# Altium project CBCM test PCB.PrjPCB
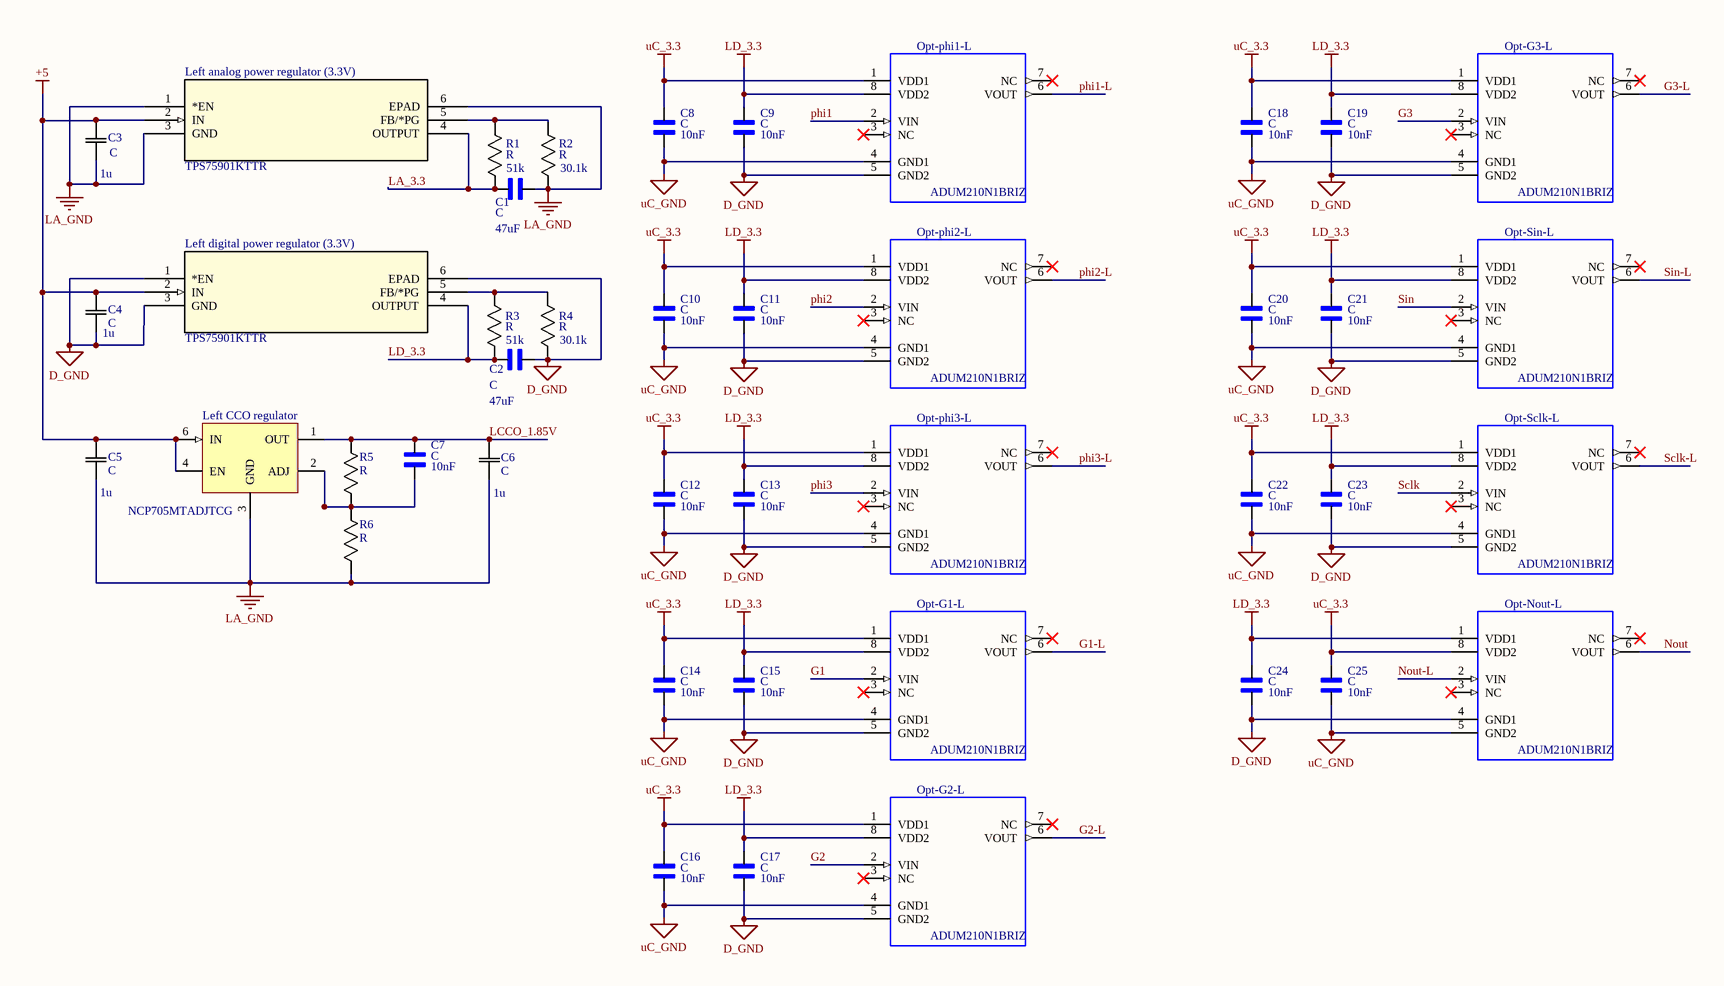
[diagram p0: IC left.SchDoc]
3 sheets, 99 parts. Net scope: global (net labels, ports and power ports of the same name join across sheets).
Board file: CBCM test PCB.PcbDoc
Sheets:
  IC left.SchDoc
  IC right.SchDoc
  IC common.SchDoc

## Sheet IC left.SchDoc
size A3

### Parts
C1  C  value 47uF  [CAPC1608X9N]
C2  C  value 47uF  [CAPC1608X9N]
C3  C  value 1u  [CAP_GRM_188]
C4  C  value 1u  [CAP_GRM_188]
C5  C  value 1u  [CAP_GRM_188]
C6  C  value 1u  [CAP_GRM_188]
C7  C  value 10nF  [CAPC1608X9N]
C8  C  value 10nF  [CAPC1608X9N]
C9  C  value 10nF  [CAPC1608X9N]
C10  C  value 10nF  [CAPC1608X9N]
C11  C  value 10nF  [CAPC1608X9N]
C12  C  value 10nF  [CAPC1608X9N]
C13  C  value 10nF  [CAPC1608X9N]
C14  C  value 10nF  [CAPC1608X9N]
C15  C  value 10nF  [CAPC1608X9N]
C16  C  value 10nF  [CAPC1608X9N]
C17  C  value 10nF  [CAPC1608X9N]
C18  C  value 10nF  [CAPC1608X9N]
C19  C  value 10nF  [CAPC1608X9N]
C20  C  value 10nF  [CAPC1608X9N]
C21  C  value 10nF  [CAPC1608X9N]
C22  C  value 10nF  [CAPC1608X9N]
C23  C  value 10nF  [CAPC1608X9N]
C24  C  value 10nF  [CAPC1608X9N]
C25  C  value 10nF  [CAPC1608X9N]
Left_analog_power_regulator_(3.3V)  TPS75901KTTR  [TO-263-5]
Left_CCO_regulator  NCP705MTADJTCG  [WDFN6]
Left_digital_power_regulator_(3.3V)  TPS75901KTTR  [TO-263-5]
Opt-G1-L  ADUM210N1BRIZ  [SOIC127P1150X330-8N]
Opt-G2-L  ADUM210N1BRIZ  [SOIC127P1150X330-8N]
Opt-G3-L  ADUM210N1BRIZ  [SOIC127P1150X330-8N]
Opt-Nout-L  ADUM210N1BRIZ  [SOIC127P1150X330-8N]
Opt-phi1-L  ADUM210N1BRIZ  [SOIC127P1150X330-8N]
Opt-phi2-L  ADUM210N1BRIZ  [SOIC127P1150X330-8N]
Opt-phi3-L  ADUM210N1BRIZ  [SOIC127P1150X330-8N]
Opt-Sclk-L  ADUM210N1BRIZ  [SOIC127P1150X330-8N]
Opt-Sin-L  ADUM210N1BRIZ  [SOIC127P1150X330-8N]
R1  R  value 51k  [RES_0816]
R2  R  value 30.1k  [RC0603N]
R3  R  value 51k  [RES_0816]
R4  R  value 30.1k  [RC0603N]
R5  R  [RC0603N]
R6  R  [RC0603N]

### Nets
+5: C3.2 C4.2 C5.2 Left_analog_power_regulator_(3.3V).2(IN) Left_CCO_regulator.4(EN) Left_CCO_regulator.6(IN) Left_digital_power_regulator_(3.3V).2(IN)
D_GND: C2.1 C4.1 C9.2 C11.2 C13.2 C15.2 C17.2 C19.2 C21.2 C23.2 C24.2 Left_digital_power_regulator_(3.3V).1(*EN) Left_digital_power_regulator_(3.3V).3(GND) Left_digital_power_regulator_(3.3V).6(EPAD) Opt-G1-L.5(GND2) Opt-G2-L.5(GND2) Opt-G3-L.5(GND2) Opt-Nout-L.4(GND1) Opt-phi1-L.5(GND2) Opt-phi2-L.5(GND2) Opt-phi3-L.5(GND2) Opt-Sclk-L.5(GND2) Opt-Sin-L.5(GND2) R4.2
LA_3.3: C1.2 Left_analog_power_regulator_(3.3V).4(OUTPUT) R1.1
LA_GND: C1.1 C3.1 C5.1 C6.1 Left_analog_power_regulator_(3.3V).1(*EN) Left_analog_power_regulator_(3.3V).3(GND) Left_analog_power_regulator_(3.3V).6(EPAD) Left_CCO_regulator.3(GND) R2.2 R6.2
LCCO_1.85V: C6.2 C7.1 Left_CCO_regulator.1(OUT) R5.1
LD_3.3: C2.2 C9.1 C11.1 C13.1 C15.1 C17.1 C19.1 C21.1 C23.1 C24.1 Left_digital_power_regulator_(3.3V).4(OUTPUT) Opt-G1-L.8(VDD2) Opt-G2-L.8(VDD2) Opt-G3-L.8(VDD2) Opt-Nout-L.1(VDD1) Opt-phi1-L.8(VDD2) Opt-phi2-L.8(VDD2) Opt-phi3-L.8(VDD2) Opt-Sclk-L.8(VDD2) Opt-Sin-L.8(VDD2) R3.1
uC_3.3: C8.1 C10.1 C12.1 C14.1 C16.1 C18.1 C20.1 C22.1 C25.1 Opt-G1-L.1(VDD1) Opt-G2-L.1(VDD1) Opt-G3-L.1(VDD1) Opt-Nout-L.8(VDD2) Opt-phi1-L.1(VDD1) Opt-phi2-L.1(VDD1) Opt-phi3-L.1(VDD1) Opt-Sclk-L.1(VDD1) Opt-Sin-L.1(VDD1)
uC_GND: C8.2 C10.2 C12.2 C14.2 C16.2 C18.2 C20.2 C22.2 C25.2 Opt-G1-L.4(GND1) Opt-G2-L.4(GND1) Opt-G3-L.4(GND1) Opt-Nout-L.5(GND2) Opt-phi1-L.4(GND1) Opt-phi2-L.4(GND1) Opt-phi3-L.4(GND1) Opt-Sclk-L.4(GND1) Opt-Sin-L.4(GND1)
G1: Opt-G1-L.2(VIN)
G1-L: Opt-G1-L.6(VOUT)
G2: Opt-G2-L.2(VIN)
G2-L: Opt-G2-L.6(VOUT)
G3: Opt-G3-L.2(VIN)
G3-L: Opt-G3-L.6(VOUT)
Nout: Opt-Nout-L.6(VOUT)
Nout-L: Opt-Nout-L.2(VIN)
phi1: Opt-phi1-L.2(VIN)
phi1-L: Opt-phi1-L.6(VOUT)
phi2: Opt-phi2-L.2(VIN)
phi2-L: Opt-phi2-L.6(VOUT)
phi3: Opt-phi3-L.2(VIN)
phi3-L: Opt-phi3-L.6(VOUT)
Sclk: Opt-Sclk-L.2(VIN)
Sclk-L: Opt-Sclk-L.6(VOUT)
Sin: Opt-Sin-L.2(VIN)
Sin-L: Opt-Sin-L.6(VOUT)
NetC7_2: C7.2 Left_CCO_regulator.2(ADJ) R5.2 R6.1
NetLeft_analog_power_regulator_(3.3V)_5: Left_analog_power_regulator_(3.3V).5(FB/*PG) R1.2 R2.1
NetLeft_digital_power_regulator_(3.3V)_5: Left_digital_power_regulator_(3.3V).5(FB/*PG) R3.2 R4.1

Not connected (* = marked no-connect by the designer): Opt-G1-L 3(NC)* 7(NC)*; Opt-G2-L 3(NC)* 7(NC)*; Opt-G3-L 3(NC)* 7(NC)*; Opt-Nout-L 3(NC)* 7(NC)*; Opt-phi1-L 3(NC)* 7(NC)*; Opt-phi2-L 3(NC)* 7(NC)*; Opt-phi3-L 3(NC)* 7(NC)*; Opt-Sclk-L 3(NC)* 7(NC)*; Opt-Sin-L 3(NC)* 7(NC)*

### Library data of the parts
C1 C2 = GRM188R60G476ME15D: Multilayer Ceramic Capacitors - 47uF 4V X5R 20% Pad SMD 0603 85C T/R; MF: Murata; Digi-Key_Part_Number: 490-13246-1-ND; SnapEDA_Link: https://www.snapeda.com/parts/GRM188R60G476ME15D/Murata%2520Electronics%2520North%2520America/view-part/?ref=snap; Package: 0603 Murata; Digi-Key_Purchase_URL: https://www.digikey.ca/product-detail/en/murata-electronics-north-america/GRM188R60G476ME15D/490-13246-1-ND/5877454?utm_source=snapeda&utm_medium=aggregator&utm_campaign=symbol; Manufacturer Part Number: GRM188R60G476ME15D
C3-C6 = GRM188R60J105KA0: Imported; Manufacturer Part Number: GRM188R60J105KA01D; Vendor: Murata; Built_By: EMA_UL_Team; Type: DEV; C: Copyright (C) 2015 Accelerated Designs. All rights reserved; RefDes: RefDes
C7-C25 = GRM1885C1H103JA01D: Multilayer Ceramic Capacitor, GRM Series, 0.01 F, 5%, C0G / NP0, 50 V, 0603 [1608 Metric]; MF: Murata; Package: 0603 Murata; Digi-Key_Purchase_URL: https://www.digikey.ca/product-detail/en/murata-electronics-north-america/GRM1885C1H103JA01D/490-9666-1-ND/4934772?utm_source=snapeda&utm_medium=aggregator&utm_campaign=symbol; Digi-Key_Part_Number: 490-9666-1-ND; SnapEDA_Link: https://www.snapeda.com/parts/GRM1885C1H103JA01D/Murata%20Electronics%20North%20America/view-part/?ref=snap; Manufacturer Part Number: GRM1885C1H103JA01D
Left_analog_power_regulator_(3.3V) Left_digital_power_regulator_(3.3V) = TPS75901KTTR: Imported; Vendor: Texas Instruments; Built_By: EMA_UL_Team; C: Copyright (C) 2015 Accelerated Designs. All rights reserved; Manufacturer: Texas Instruments; RefDes: RefDes; Type: DEV; Value: Value; Manufacturer Part Number: TPS75901KTTR
Left_CCO_regulator = NCP705MTADJTCG: 500 mA, Ultra-Low  Quiescent Current, IQ 13 A,  Ultra-Low Noise, LDO  Voltage Regulator; Manufacturer: ON Semiconductor; Manufacturer Part Number: NCP705MTADJTCG; Digi-Key link: https://www.digikey.ca/product-detail/en/on-semiconductor/NCP705MTADJTCG/NCP705MTADJTCGOSCT-ND/8538627
Opt-G1-L Opt-G2-L Opt-G3-L Opt-Nout-L Opt-phi1-L Opt-phi2-L Opt-phi3-L Opt-Sclk-L Opt-Sin-L = ADUM210N1BRIZ: Digital isolator 1-CH 8-Pin SOIC T/R; MF: Analog Devices; Digi-Key_Purchase_URL: https://www.digikey.ca/product-detail/en/analog-devices-inc/ADUM210N1BRIZ/ADUM210N1BRIZ-ND/6072296; Package: SOIC8; Digi-Key_Part_Number: ADUM210N1BRIZ-ND; SnapEDA_Link: https://www.snapeda.com/parts/ACPL-072L-500E/Broadcom/view-part/?ref=snap; Value: *; Manufacturer Part Number: ADUM210N1BRIZ
R1 R3 = RR0816P-513-D: Imported; Vendor: Susumu; Built_By: EMA_UL_Team; C: Copyright (C) 2015 Accelerated Designs. All rights reserved; RefDes: RefDes; Type: DEV; Manufacturer Part Number: RR0816P-513-D
R2 R4 = RT0603BRD0730K1L: Imported; Vendor: Yageo; Built_By: EMA_UL_Team; C: Copyright (C) 2015 Accelerated Designs. All rights reserved; RefDes: RefDes; Type: DEV; Manufacturer Part Number: RT0603BRD0730K1L
R5 = RC0603FR-07130KL: Imported; Vendor: Yageo; Built_By: EMA_UL_Team; Value: 130k; C: Copyright (C) 2015 Accelerated Designs. All rights reserved; RefDes: RefDes; Type: DEV; Manufacturer Part Number: RC0603FR-07130KL
R6 = ERJ-3GEY0R00V: Imported; Vendor: Panasonic; Built_By: EMA_UL_Team; Value: 98.8k; C: Copyright (C) 2015 Accelerated Designs. All rights reserved; RefDes: RefDes; Type: DEV; Manufacturer Part Number: ERJ-3GEY0R00V

## Sheet IC right.SchDoc
size A3
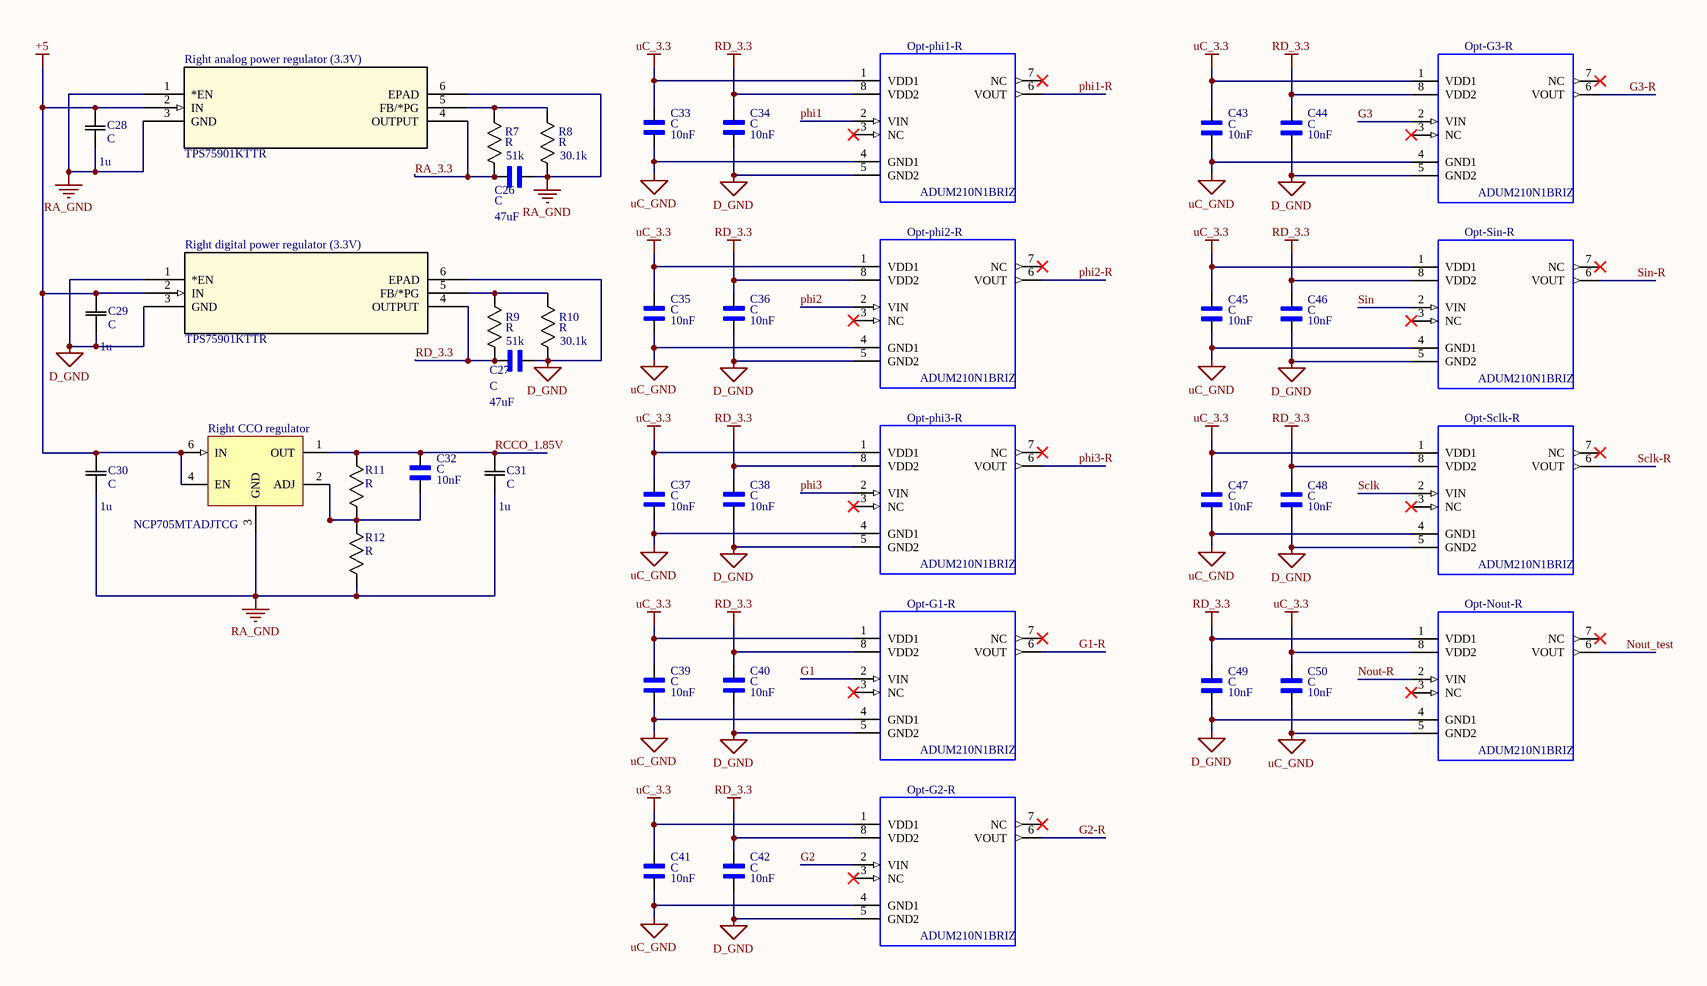
[diagram p1: IC right.SchDoc]

### Parts
C26  C  value 47uF  [CAPC1608X9N]
C27  C  value 47uF  [CAPC1608X9N]
C28  C  value 1u  [CAP_GRM_188]
C29  C  value 1u  [CAP_GRM_188]
C30  C  value 1u  [CAP_GRM_188]
C31  C  value 1u  [CAP_GRM_188]
C32  C  value 10nF  [CAPC1608X9N]
C33  C  value 10nF  [CAPC1608X9N]
C34  C  value 10nF  [CAPC1608X9N]
C35  C  value 10nF  [CAPC1608X9N]
C36  C  value 10nF  [CAPC1608X9N]
C37  C  value 10nF  [CAPC1608X9N]
C38  C  value 10nF  [CAPC1608X9N]
C39  C  value 10nF  [CAPC1608X9N]
C40  C  value 10nF  [CAPC1608X9N]
C41  C  value 10nF  [CAPC1608X9N]
C42  C  value 10nF  [CAPC1608X9N]
C43  C  value 10nF  [CAPC1608X9N]
C44  C  value 10nF  [CAPC1608X9N]
C45  C  value 10nF  [CAPC1608X9N]
C46  C  value 10nF  [CAPC1608X9N]
C47  C  value 10nF  [CAPC1608X9N]
C48  C  value 10nF  [CAPC1608X9N]
C49  C  value 10nF  [CAPC1608X9N]
C50  C  value 10nF  [CAPC1608X9N]
Opt-G1-R  ADUM210N1BRIZ  [SOIC127P1150X330-8N]
Opt-G2-R  ADUM210N1BRIZ  [SOIC127P1150X330-8N]
Opt-G3-R  ADUM210N1BRIZ  [SOIC127P1150X330-8N]
Opt-Nout-R  ADUM210N1BRIZ  [SOIC127P1150X330-8N]
Opt-phi1-R  ADUM210N1BRIZ  [SOIC127P1150X330-8N]
Opt-phi2-R  ADUM210N1BRIZ  [SOIC127P1150X330-8N]
Opt-phi3-R  ADUM210N1BRIZ  [SOIC127P1150X330-8N]
Opt-Sclk-R  ADUM210N1BRIZ  [SOIC127P1150X330-8N]
Opt-Sin-R  ADUM210N1BRIZ  [SOIC127P1150X330-8N]
R7  R  value 51k  [RES_0816]
R8  R  value 30.1k  [RC0603N]
R9  R  value 51k  [RES_0816]
R10  R  value 30.1k  [RC0603N]
R11  R  [RC0603N]
R12  R  [RC0603N]
Right_analog_power_regulator_(3.3V)  TPS75901KTTR  [TO-263-5]
Right_CCO_regulator  NCP705MTADJTCG  [WDFN6]
Right_digital_power_regulator_(3.3V)  TPS75901KTTR  [TO-263-5]

### Nets
+5: C28.2 C29.2 C30.2 Right_analog_power_regulator_(3.3V).2(IN) Right_CCO_regulator.4(EN) Right_CCO_regulator.6(IN) Right_digital_power_regulator_(3.3V).2(IN)
D_GND: C27.1 C29.1 C34.2 C36.2 C38.2 C40.2 C42.2 C44.2 C46.2 C48.2 C49.2 Opt-G1-R.5(GND2) Opt-G2-R.5(GND2) Opt-G3-R.5(GND2) Opt-Nout-R.4(GND1) Opt-phi1-R.5(GND2) Opt-phi2-R.5(GND2) Opt-phi3-R.5(GND2) Opt-Sclk-R.5(GND2) Opt-Sin-R.5(GND2) R10.2 Right_digital_power_regulator_(3.3V).1(*EN) Right_digital_power_regulator_(3.3V).3(GND) Right_digital_power_regulator_(3.3V).6(EPAD)
RA_3.3: C26.2 R7.1 Right_analog_power_regulator_(3.3V).4(OUTPUT)
RA_GND: C26.1 C28.1 C30.1 C31.1 R8.2 R12.2 Right_analog_power_regulator_(3.3V).1(*EN) Right_analog_power_regulator_(3.3V).3(GND) Right_analog_power_regulator_(3.3V).6(EPAD) Right_CCO_regulator.3(GND)
RCCO_1.85V: C31.2 C32.1 R11.1 Right_CCO_regulator.1(OUT)
RD_3.3: C27.2 C34.1 C36.1 C38.1 C40.1 C42.1 C44.1 C46.1 C48.1 C49.1 Opt-G1-R.8(VDD2) Opt-G2-R.8(VDD2) Opt-G3-R.8(VDD2) Opt-Nout-R.1(VDD1) Opt-phi1-R.8(VDD2) Opt-phi2-R.8(VDD2) Opt-phi3-R.8(VDD2) Opt-Sclk-R.8(VDD2) Opt-Sin-R.8(VDD2) R9.1 Right_digital_power_regulator_(3.3V).4(OUTPUT)
uC_3.3: C33.1 C35.1 C37.1 C39.1 C41.1 C43.1 C45.1 C47.1 C50.1 Opt-G1-R.1(VDD1) Opt-G2-R.1(VDD1) Opt-G3-R.1(VDD1) Opt-Nout-R.8(VDD2) Opt-phi1-R.1(VDD1) Opt-phi2-R.1(VDD1) Opt-phi3-R.1(VDD1) Opt-Sclk-R.1(VDD1) Opt-Sin-R.1(VDD1)
uC_GND: C33.2 C35.2 C37.2 C39.2 C41.2 C43.2 C45.2 C47.2 C50.2 Opt-G1-R.4(GND1) Opt-G2-R.4(GND1) Opt-G3-R.4(GND1) Opt-Nout-R.5(GND2) Opt-phi1-R.4(GND1) Opt-phi2-R.4(GND1) Opt-phi3-R.4(GND1) Opt-Sclk-R.4(GND1) Opt-Sin-R.4(GND1)
G1: Opt-G1-R.2(VIN)
G1-R: Opt-G1-R.6(VOUT)
G2: Opt-G2-R.2(VIN)
G2-R: Opt-G2-R.6(VOUT)
G3: Opt-G3-R.2(VIN)
G3-R: Opt-G3-R.6(VOUT)
Nout-R: Opt-Nout-R.2(VIN)
Nout_test: Opt-Nout-R.6(VOUT)
phi1: Opt-phi1-R.2(VIN)
phi1-R: Opt-phi1-R.6(VOUT)
phi2: Opt-phi2-R.2(VIN)
phi2-R: Opt-phi2-R.6(VOUT)
phi3: Opt-phi3-R.2(VIN)
phi3-R: Opt-phi3-R.6(VOUT)
Sclk: Opt-Sclk-R.2(VIN)
Sclk-R: Opt-Sclk-R.6(VOUT)
Sin: Opt-Sin-R.2(VIN)
Sin-R: Opt-Sin-R.6(VOUT)
NetC32_2: C32.2 R11.2 R12.1 Right_CCO_regulator.2(ADJ)
NetR7_2: R7.2 R8.1 Right_analog_power_regulator_(3.3V).5(FB/*PG)
NetR9_2: R9.2 R10.1 Right_digital_power_regulator_(3.3V).5(FB/*PG)

Not connected (* = marked no-connect by the designer): Opt-G1-R 3(NC)* 7(NC)*; Opt-G2-R 3(NC)* 7(NC)*; Opt-G3-R 3(NC)* 7(NC)*; Opt-Nout-R 3(NC)* 7(NC)*; Opt-phi1-R 3(NC)* 7(NC)*; Opt-phi2-R 3(NC)* 7(NC)*; Opt-phi3-R 3(NC)* 7(NC)*; Opt-Sclk-R 3(NC)* 7(NC)*; Opt-Sin-R 3(NC)* 7(NC)*

### Library data of the parts
C26 C27 = GRM188R60G476ME15D: as C1 on sheet IC left; Digi-Key_Part_Number: 490-13246-1-ND; SnapEDA_Link: https://www.snapeda.com/parts/GRM188R60G476ME15D/Murata%2520Electronics%2520North%2520America/view-part/?ref=snap; Package: 0603 Murata; Digi-Key_Purchase_URL: https://www.digikey.ca/product-detail/en/murata-electronics-north-america/GRM188R60G476ME15D/490-13246-1-ND/5877454?utm_source=snapeda&utm_medium=aggregator&utm_campaign=symbol; Manufacturer Part Number: GRM188R60G476ME15D
C28-C31 = GRM188R60J105KA0: as C3 on sheet IC left; RefDes: RefDes
C32-C50 = GRM1885C1H103JA01D: as C7 on sheet IC left; Package: 0603 Murata; Digi-Key_Purchase_URL: https://www.digikey.ca/product-detail/en/murata-electronics-north-america/GRM1885C1H103JA01D/490-9666-1-ND/4934772?utm_source=snapeda&utm_medium=aggregator&utm_campaign=symbol; Digi-Key_Part_Number: 490-9666-1-ND; SnapEDA_Link: https://www.snapeda.com/parts/GRM1885C1H103JA01D/Murata%20Electronics%20North%20America/view-part/?ref=snap; Manufacturer Part Number: GRM1885C1H103JA01D
Opt-G1-R Opt-G2-R Opt-G3-R Opt-Nout-R Opt-phi1-R Opt-phi2-R Opt-phi3-R Opt-Sclk-R Opt-Sin-R = ADUM210N1BRIZ: as Opt-G1-L on sheet IC left; Digi-Key_Purchase_URL: https://www.digikey.ca/product-detail/en/analog-devices-inc/ADUM210N1BRIZ/ADUM210N1BRIZ-ND/6072296; Package: SOIC8; Digi-Key_Part_Number: ADUM210N1BRIZ-ND; SnapEDA_Link: https://www.snapeda.com/parts/ACPL-072L-500E/Broadcom/view-part/?ref=snap; Value: *; Manufacturer Part Number: ADUM210N1BRIZ
R7 R9 = RR0816P-513-D: as R1 on sheet IC left; RefDes: RefDes; Type: DEV; Manufacturer Part Number: RR0816P-513-D
R8 R10 = RT0603BRD0730K1L: as R2 on sheet IC left; RefDes: RefDes; Type: DEV; Manufacturer Part Number: RT0603BRD0730K1L
R11 = RC0603FR-07130KL: as R5 on sheet IC left; RefDes: RefDes; Type: DEV; Manufacturer Part Number: RC0603FR-07130KL
R12 = ERJ-3GEY0R00V: as R6 on sheet IC left; RefDes: RefDes; Type: DEV; Manufacturer Part Number: ERJ-3GEY0R00V
Right_analog_power_regulator_(3.3V) Right_digital_power_regulator_(3.3V) = TPS75901KTTR: as Left_analog_power_regulator_(3.3V) on sheet IC left; Manufacturer: Texas Instruments; RefDes: RefDes; Type: DEV; Value: Value; Manufacturer Part Number: TPS75901KTTR
Right_CCO_regulator = NCP705MTADJTCG: as Left_CCO_regulator on sheet IC left; Manufacturer Part Number: NCP705MTADJTCG; Digi-Key link: https://www.digikey.ca/product-detail/en/on-semiconductor/NCP705MTADJTCG/NCP705MTADJTCGOSCT-ND/8538627

## Sheet IC common.SchDoc
size A3
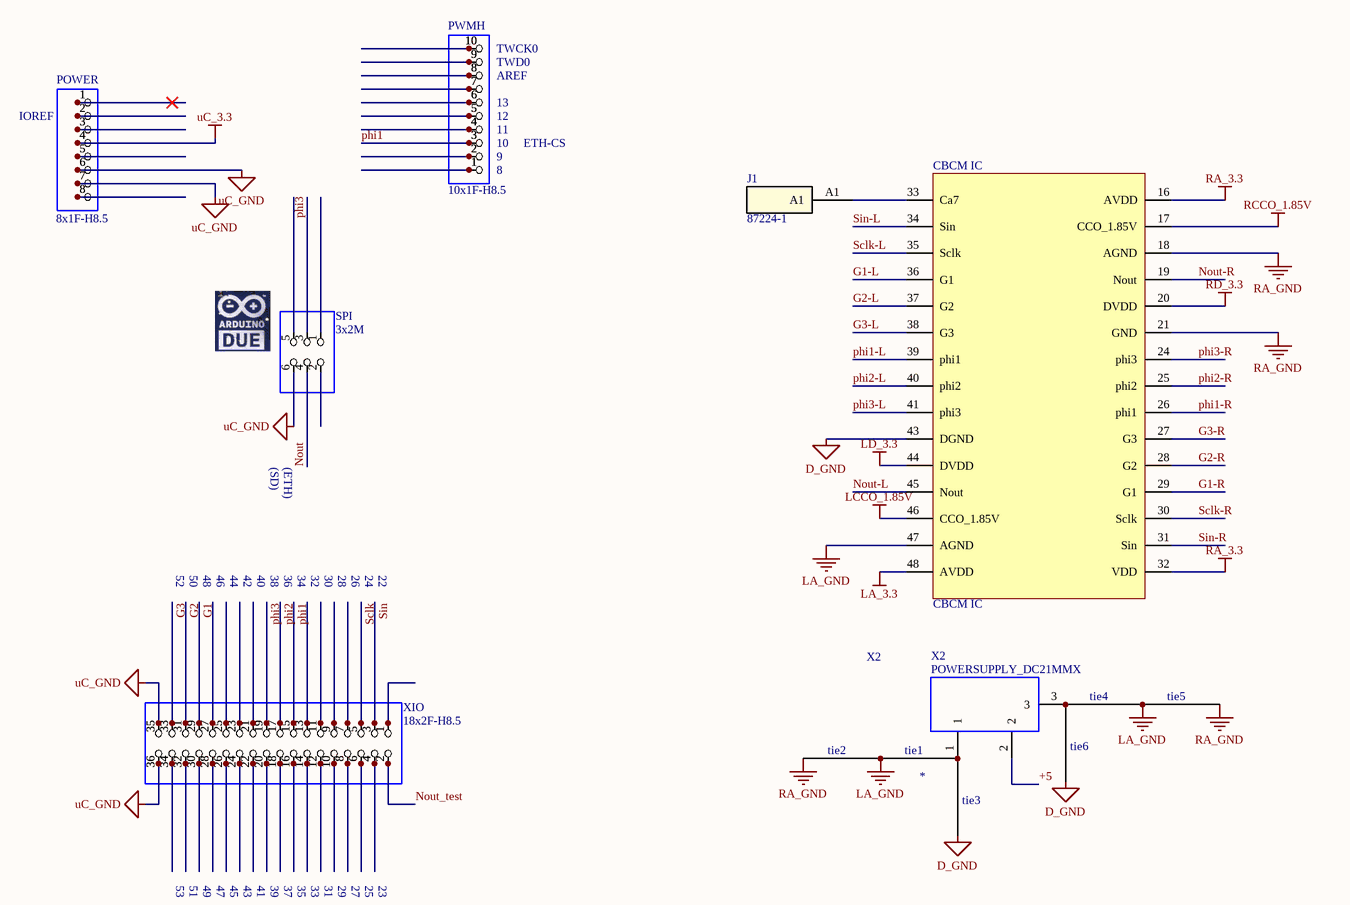
[diagram p2: IC common.SchDoc]

### Parts
CBCM_IC  CBCM IC  [PGA85x11]
J1  87224-1  [87224-1]
POWER  8x1F-H8.5  [1X08]
PWMH  10x1F-H8.5  [1X10]
SPI  3x2M  [2X03]
tie1  Net Tie  [net_tie]  (value not drawn)  (net tie, no BOM)
tie2  Net Tie  [net_tie]  (value not drawn)  (net tie, no BOM)
tie3  Net Tie  [net_tie]  (value not drawn)  (net tie, no BOM)
tie4  Net Tie  [net_tie]  (value not drawn)  (net tie, no BOM)
tie5  Net Tie  [net_tie]  (value not drawn)  (net tie, no BOM)
tie6  Net Tie  [net_tie]  (value not drawn)  (net tie, no BOM)
X2  *  [POWERSUPPLY_DC-21MM]
XIO  18x2F-H8.5  [2X18]

### Nets
+5: X2.2
D_GND: CBCM_IC.43(DGND) tie3.0 tie6.0
LA_3.3: CBCM_IC.48(AVDD)
LA_GND: CBCM_IC.47(AGND) tie1.0 tie2.1 tie4.1 tie5.0
LCCO_1.85V: CBCM_IC.46(CCO_1.85V)
LD_3.3: CBCM_IC.44(DVDD)
RA_3.3: CBCM_IC.16(AVDD) CBCM_IC.32(VDD)
RA_GND: CBCM_IC.18(AGND) CBCM_IC.21(GND) tie2.0 tie5.1
RCCO_1.85V: CBCM_IC.17(CCO_1.85V)
RD_3.3: CBCM_IC.20(DVDD)
uC_3.3: POWER.4
uC_GND: POWER.6 POWER.7 SPI.6 XIO.35 XIO.36
G1: XIO.29
G1-L: CBCM_IC.36(G1)
G1-R: CBCM_IC.29(G1)
G2: XIO.31
G2-L: CBCM_IC.37(G2)
G2-R: CBCM_IC.28(G2)
G3: XIO.33
G3-L: CBCM_IC.38(G3)
G3-R: CBCM_IC.27(G3)
Nout: SPI.4
Nout-L: CBCM_IC.45(Nout)
Nout-R: CBCM_IC.19(Nout)
Nout_test: XIO.2
phi1: PWMH.3 XIO.15
phi1-L: CBCM_IC.39(phi1)
phi1-R: CBCM_IC.26(phi1)
phi2: XIO.17
phi2-L: CBCM_IC.40(phi2)
phi2-R: CBCM_IC.25(phi2)
phi3: SPI.3 XIO.19
phi3-L: CBCM_IC.41(phi3)
phi3-R: CBCM_IC.24(phi3)
Sclk: XIO.5
Sclk-L: CBCM_IC.35(Sclk)
Sclk-R: CBCM_IC.30(Sclk)
Sin: XIO.3
Sin-L: CBCM_IC.34(Sin)
Sin-R: CBCM_IC.31(Sin)
NetCBCM_IC_33: CBCM_IC.33(Ca7) J1.A1
Nettie1_1: tie1.1 tie3.1 X2.1
Nettie4_0: tie4.0 tie6.1 X2.3

Not connected (* = marked no-connect by the designer): POWER 1* 2 3 5 8; PWMH 1 2 4 5 6 7 8 9 10; SPI 1 2 5; XIO 1 4 6 7 8 9 10 11 12 13 14 16 18 20 21 22 23 24 25 26 27 28 30 32 34

### Notes on the sheet
- (near PWMH) TWCK0
- (near PWMH) TWD0
- (near POWER) IOREF
- (near PWMH) 11
- (near PWMH) 12
- (near PWMH) 13
- (near PWMH) AREF
- (near PWMH) 8
- (near PWMH) 9
- (near PWMH) 10
- (near PWMH) ETH-CS
- (SD)
- (ETH)
- 52
- 50
- 48
- 46
- 44
- 42
- 40
- 38
- 36
- 34
- 32
- 30
- 28
- 26
- 24
- 22
- 53
- 51
- 49
- 47
- 45
- 43
- 41
- 39
- 37
- 35
- 33
- 31
- 29
- 27
- 25
- 23

### Library data of the parts
CBCM_IC = CBCM IC: pin to pad: 16>H1 17>H2 18>J1 19>K1 20>J2 21>L1 24>L2 25>L3 26>K4 27>L4 28>J5 29>K5 30>L5 31>K6 32>J6 33>J7 34>L7 35>K7 36>L6 37>L8 38>K8 39>L9 40>L10 41>K9 43>K10 44>J10 45>K11 46>J11 47>H10 48>H11
J1 = 87224-1: Imported; pin to pad: A1>1; Vendor: TE Connectivity; Built_By: EMA_UL_Team; C: Copyright (C) 2015 Accelerated Designs. All rights reserved; Manufacturer_Part_Number: 87224-1; RefDes: RefDes; Type: DEV; Value: Value
POWER = PINHD-1X8
PWMH = PINHD-1X10
SPI = PINHD-2X3
X2 = POWERSUPPLY_DC21MMX
XIO = PINHD-2X18

## Nets that join several sheets
+5: IC left (7 pins), IC right (7 pins), IC common (X2.2)
D_GND: IC left (24 pins), IC right (24 pins), IC common (CBCM_IC.43 tie3.0 tie6.0)
LA_3.3: IC left (C1.2 Left_analog_power_regulator_(3.3V).4 R1.1), IC common (CBCM_IC.48)
LA_GND: IC left (10 pins), IC common (5 pins)
LCCO_1.85V: IC left (C6.2 C7.1 Left_CCO_regulator.1 R5.1), IC common (CBCM_IC.46)
LD_3.3: IC left (21 pins), IC common (CBCM_IC.44)
RA_3.3: IC right (C26.2 R7.1 Right_analog_power_regulator_(3.3V).4), IC common (CBCM_IC.16 CBCM_IC.32)
RA_GND: IC right (10 pins), IC common (CBCM_IC.18 CBCM_IC.21 tie2.0 tie5.1)
RCCO_1.85V: IC right (C31.2 C32.1 R11.1 Right_CCO_regulator.1), IC common (CBCM_IC.17)
RD_3.3: IC right (21 pins), IC common (CBCM_IC.20)
uC_3.3: IC left (18 pins), IC right (18 pins), IC common (POWER.4)
uC_GND: IC left (18 pins), IC right (18 pins), IC common (5 pins)
G1: IC left (Opt-G1-L.2), IC right (Opt-G1-R.2), IC common (XIO.29)
G1-L: IC left (Opt-G1-L.6), IC common (CBCM_IC.36)
G1-R: IC right (Opt-G1-R.6), IC common (CBCM_IC.29)
G2: IC left (Opt-G2-L.2), IC right (Opt-G2-R.2), IC common (XIO.31)
G2-L: IC left (Opt-G2-L.6), IC common (CBCM_IC.37)
G2-R: IC right (Opt-G2-R.6), IC common (CBCM_IC.28)
G3: IC left (Opt-G3-L.2), IC right (Opt-G3-R.2), IC common (XIO.33)
G3-L: IC left (Opt-G3-L.6), IC common (CBCM_IC.38)
G3-R: IC right (Opt-G3-R.6), IC common (CBCM_IC.27)
Nout: IC left (Opt-Nout-L.6), IC common (SPI.4)
Nout-L: IC left (Opt-Nout-L.2), IC common (CBCM_IC.45)
Nout-R: IC right (Opt-Nout-R.2), IC common (CBCM_IC.19)
Nout_test: IC right (Opt-Nout-R.6), IC common (XIO.2)
phi1: IC left (Opt-phi1-L.2), IC right (Opt-phi1-R.2), IC common (PWMH.3 XIO.15)
phi1-L: IC left (Opt-phi1-L.6), IC common (CBCM_IC.39)
phi1-R: IC right (Opt-phi1-R.6), IC common (CBCM_IC.26)
phi2: IC left (Opt-phi2-L.2), IC right (Opt-phi2-R.2), IC common (XIO.17)
phi2-L: IC left (Opt-phi2-L.6), IC common (CBCM_IC.40)
phi2-R: IC right (Opt-phi2-R.6), IC common (CBCM_IC.25)
phi3: IC left (Opt-phi3-L.2), IC right (Opt-phi3-R.2), IC common (SPI.3 XIO.19)
phi3-L: IC left (Opt-phi3-L.6), IC common (CBCM_IC.41)
phi3-R: IC right (Opt-phi3-R.6), IC common (CBCM_IC.24)
Sclk: IC left (Opt-Sclk-L.2), IC right (Opt-Sclk-R.2), IC common (XIO.5)
Sclk-L: IC left (Opt-Sclk-L.6), IC common (CBCM_IC.35)
Sclk-R: IC right (Opt-Sclk-R.6), IC common (CBCM_IC.30)
Sin: IC left (Opt-Sin-L.2), IC right (Opt-Sin-R.2), IC common (XIO.3)
Sin-L: IC left (Opt-Sin-L.6), IC common (CBCM_IC.34)
Sin-R: IC right (Opt-Sin-R.6), IC common (CBCM_IC.31)